# EAGLE design Adafruit HUZZAH ESP8266 Basic Breakout (EAGLE 9.5.2)
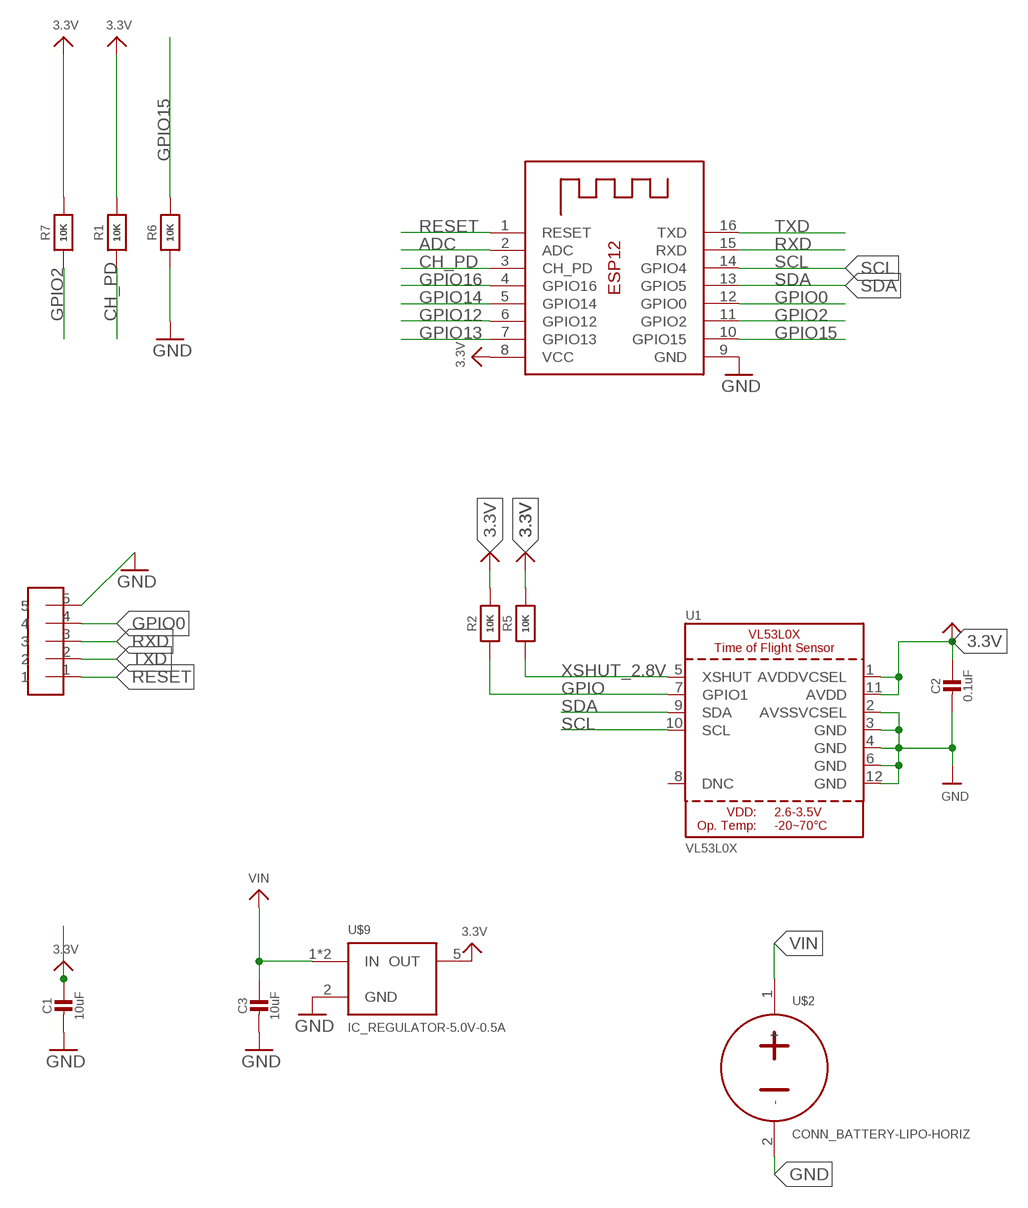
[diagram p0: schematic, sheet 1]

## Parts
C1  10uF  CAP_CERAMIC0805-NOOUTLINE  [0805-NO]
C2  0.1uF  CAP_CERAMIC0805-NOOUTLINE  [0805-NO]
C3  10uF  CAP_CERAMIC0805-NOOUTLINE  [0805-NO]
R1  10K  RESISTOR0805_NOOUTLINE  [0805-NO]
R2  10K  RESISTOR0805_NOOUTLINE  [0805-NO]
R5  10K  RESISTOR0805_NOOUTLINE  [0805-NO]
R6  10K  RESISTOR0805_NOOUTLINE  [0805-NO]
R7  10K  RESISTOR0805_NOOUTLINE  [0805-NO]
U1  VL53L0X  [LGA12_ST]
U$2  CONN_BATTERY-LIPO-HORIZ  [JST-PH-2-SMT-RA]
U$4  HEADER-5-TESTPOINT  [TESTPOINT-5]
U$9  IC_REGULATOR-5.0V-0.5A  [SOT23-5]
X1  ESP-12  [ESP-12]

## Nets
3.3V: C2.1 R1.2 R2.2 R5.2 R7.2 U1.1(AVDDVCSEL) U1.11(AVDD) U$9.5(OUT) X1.8(VCC) ; supply symbol labelled 2.8V
ADC: X1.2(ADC)
CH_PD: R1.1 X1.3(CH_PD)
GND: C1.2 C2.2 C3.2 R6.1 U1.2(AVSSVCSEL) U1.3(GND) U1.4(GND) U1.6(GND) U1.12(GND) U$2.2(-) U$4.5 U$9.2(GND) X1.9(GND)
GPIO: R2.1 U1.7(GPIO1)
GPIO0: U$4.4 X1.12(GPIO0)
GPIO2: R7.1 X1.11(GPIO2)
GPIO12: X1.6(GPIO12)
GPIO13: X1.7(GPIO13)
GPIO14: X1.5(GPIO14)
GPIO15: R6.2 X1.10(GPIO15)
GPIO16: X1.4(GPIO16)
RESET: U$4.1 X1.1(RESET)
RXD: U$4.3 X1.15(RXD)
SCL: U1.10(SCL) X1.14(GPIO4)
SDA: U1.9(SDA) X1.13(GPIO5)
TXD: U$4.2 X1.16(TXD)
VIN: C1.1 C3.1 U$2.1(+) U$9.1(IN) U$9.3(IN) ; supply symbol labelled 3.3V
XSHUT_2.8V: R5.1 U1.5(XSHUT)
Unconnected: U1.8(DNC)

## Library data of the parts
C1-C3 = microbuilder:CAP_CERAMIC: Ceramic Capacitors For new designs, use the packages preceded by an '_' character since they are more reliable: The following footprints should be used on most boards: _0402 - Standard footprint for regular board layouts _0603 - Standard footprint for regular board layouts _0805 - Standard footprint for regular board layouts _1206 - Standard footprint for regular board layouts For extremely tight-pitch boards where space is at a premium, the following 'micro-pitch' footprints can be used (smaller pads, no silkscreen outline, etc.): _0402MP - Micro-pitch footprint for very dense/compact boards _0603MP - Micro-pitch footprint for very dense/compact boards _0805MP - Micro-pitch footprint for very dense/compact boards _1206MP - Micro-pitch footprint for very dense/compact boards
R1 R2 R5-R7 = microbuilder:RESISTOR: Resistors For new designs, use the packages preceded by an '_' character since they are more reliable: The following footprints should be used on most boards: _0402 - Standard footprint for regular board layouts _0603 - Standard footprint for regular board layouts _0805 - Standard footprint for regular board layouts _1206 - Standard footprint for regular board layouts For extremely tight-pitch boards where space is at a premium, the following 'micro-pitch' footprints can be used (smaller pads, no silkscreen outline, etc.): _0402MP - Micro-pitch footprint for very dense/compact boards _0603MP - Micro-pitch footprint for very dense/compact boards _0805MP - Micro-pitch footprint for very dense/compact boards _1206MP - Micro-pitch footprint for very dense/compact boards
U1 = microbuilder:VL53L0X: VL53L0X - Laser Time of Flight Sensor (2M range)
U$2 = homemade-hardware:CONN_BATTERY
U$4 = homemade-hardware:HEADER-5: NPTC081KFXC-RC <https://www.digikey.com/product-detail/en/sullins-connector-solutions/NPTC081KFXC-RC/S5600-ND/776058>: Vertical Female SMD Headers TSM-110-01-T-SV <https://www.digikey.com/product-detail/en/samtec-inc/TSM-110-01-T-SV/SAM12267-ND/6691889>: Vertical Male SMD Headers M20-8890845 <https://www.digikey.com/products/en?keywords=952-3236-ND>: Horizontal Male SMD Headers M20-7910842R <https://www.digikey.com/product-detail/en/harwin-inc/M20-7910842R/952-3200-6-ND/6559341>: Horizontal Female SMD Headers
U$9 = homemade-hardware:IC_REGULATOR: SPX3819M5-L-5-0/TR <https://www.digikey.com/product-detail/en/maxlinear-inc/SPX3819M5-L-5-0-TR/1016-1874-6-ND/3586704>: 5.0V/0.5A SMD Linear Regulator SPX3819M5-L-3-3/TR <https://www.digikey.com/product-detail/en/maxlinear-inc/SPX3819M5-L-3-3-TR/1016-1873-6-ND/3586703>: 3.3V/0.5A SMD Linear Regulator; PN: SPX3819M5-L-5-0/TR
X1 = microbuilder:ESP-12

## Board
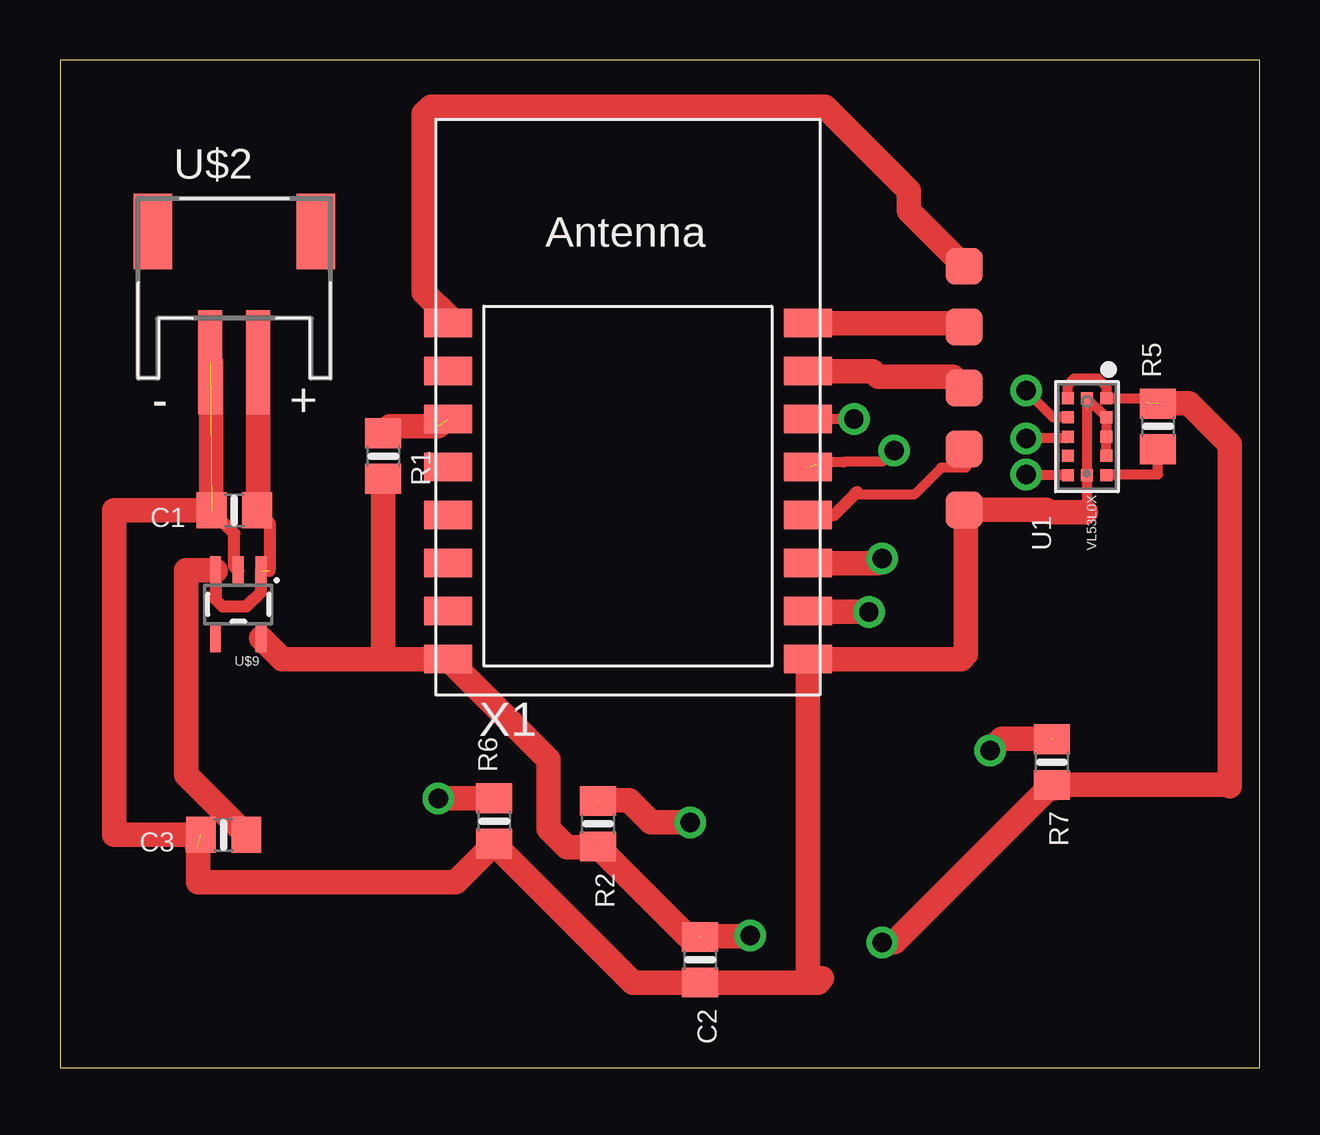
[diagram p1: board, top side]
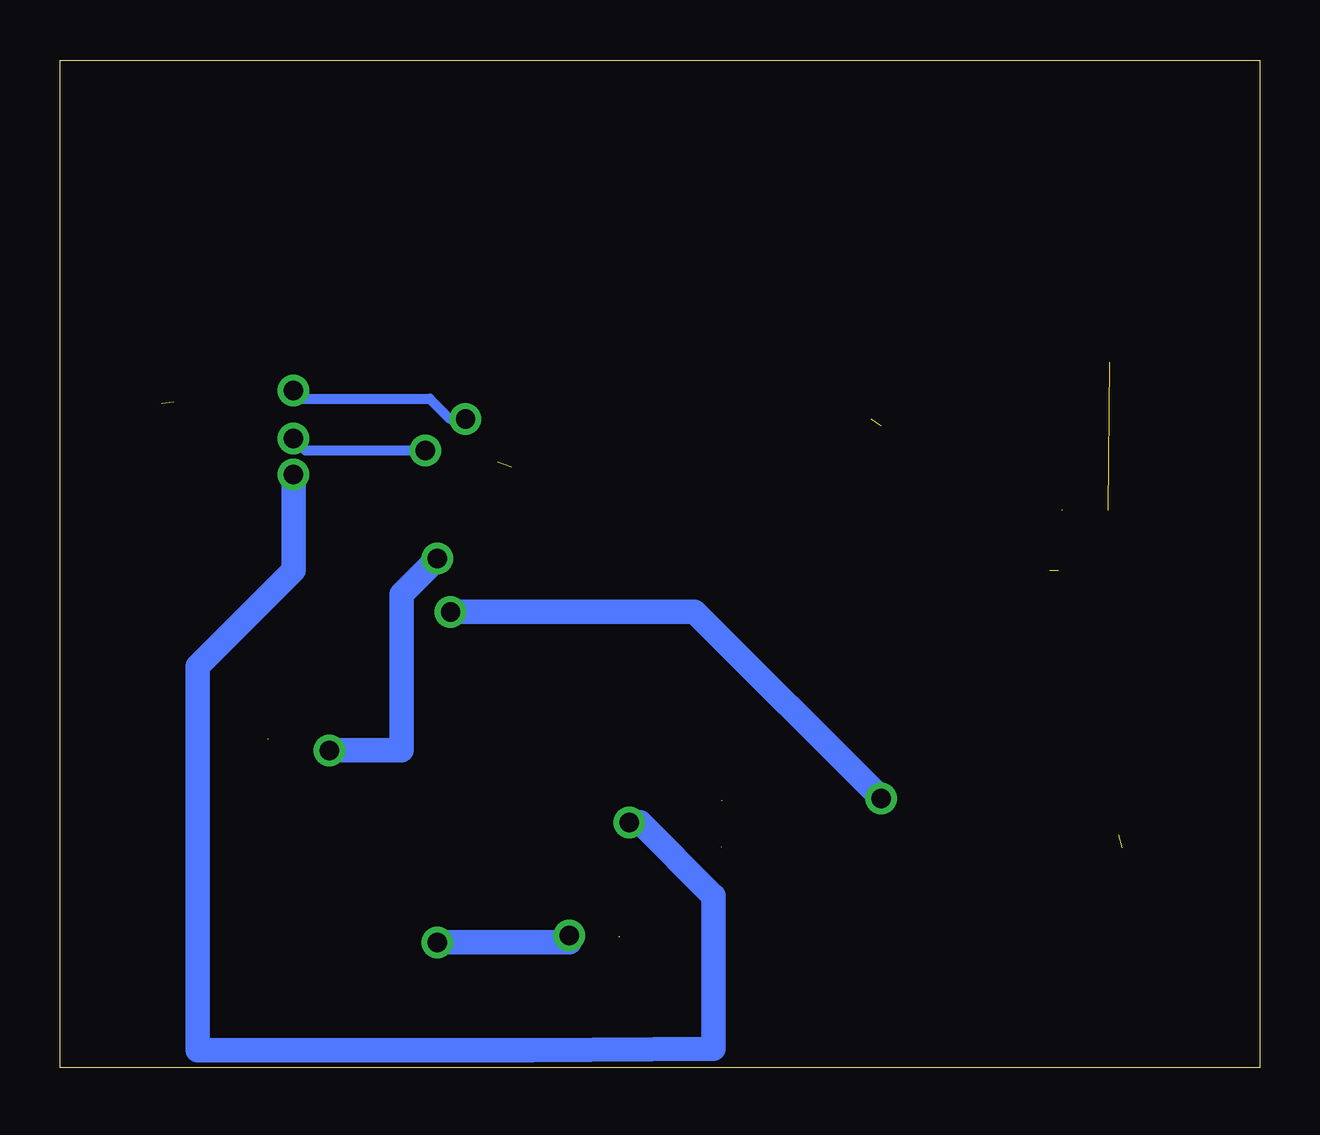
[diagram p2: board, bottom side, seen from below]

Size 50 x 42 mm. Coordinates in mm from the lower left corner, seen from the top.
Outline: 0,0 50,0 50,42 0,42 0,0
Copper layers (1*16): Top 0.035mm / dielectric 1.5mm / Bottom 0.035mm
Design rules "default": minimum track width 16mil, minimum drill 0.8mm, track to track 0.8mm, track to pad 0.8mm, pad to pad 0.8mm, via to via 0.8mm, smd to smd 0mil, copper to edge 1mil, drill to drill 1mil, minimum pad ring 10mil, minimum via ring 10mil, stop-mask expansion 1mil, vias tented up to drill 30mil, thermal gap 10mil

### Footprints (pad centres in the part's own frame; a part is rotated, then mirrored left to right if it is on the bottom)
0805-NO = smd 1.24 x 1.5: 1 -0.95,0; 2 0.95,0
LGA12_ST = smd 0.5 x 0.5: 1 1.6,-0.8; 2 0.8,-0.8; 3 0,-0.8; 4 -0.8,-0.8; 5 -1.6,-0.8; 6 -1.6,0; 7 -1.6,0.8; 8 -0.8,0.8; 9 0,0.8; 10 0.8,0.8; 11 1.6,0.8; 12 1.6,0
JST-PH-2-SMT-RA = smd 1 x 4.35: 1 1,-3.825; 2 -1,-3.825 | smd 1.6 x 3.15: NC1 -3.4,1.625; NC2 3.4,1.625
TESTPOINT-5 = smd 1.524 x 1.524: 1 0,0; 2 2.54,0; 3 5.08,0; 4 7.62,0; 5 10.16,0
SOT23-5 = smd 0.45 x 1.2: 1 -0.95,-1.4; 2 0,-1.4; 3 0.95,-1.4; 4 0.95,1.4; 5 -0.95,1.4
ESP-12 = smd 2 x 1.2: 1 -7.5,4.5; 2 -7.5,2.5; 3 -7.5,0.5; 4 -7.5,-1.5; 5 -7.5,-3.5; 6 -7.5,-5.5; 7 -7.5,-7.5; 8 -7.5,-9.5; 9 7.5,-9.5; 10 7.5,-7.5; 11 7.5,-5.5; 12 7.5,-3.5; 13 7.5,-1.5; 14 7.5,0.5; 15 7.5,2.5; 16 7.5,4.5

### Placement (x,y rotation side)
C1  7.27,23.23 180 top
C2  26.68,4.51 270 top
C3  6.82,9.71 180 top
R1  13.47,25.5 270 top
R2  22.43,10.17 270 top
R5  45.77,26.73 90 top
R6  18.1,10.29 90 top
R7  41.35,12.74 270 top
U1  42.81,26.31 90 top
U$2  7.27,33.23 0 top
U$4  37.69,33.41 270 top
U$9  7.43,19.31 180 top
X1  23.67,26.54 0 top

### Tracks (layer width: path | path; a pad name or v marks a point on that pad's centre or on a via)
3.3V  (via drill 0.8)  (4 unrouted)
  Top 0.406: 45.27,27.73 45.09,27.91 U1.1 43.61,28.39 43.27,28.73 42.27,28.73 42.01,28.47 U1.11
  Top 1.016: 41.47,11.66 R7.2 | U$9.5 9.25,17.04 13.27,17.04 | 13.27,17.04 X1.8 20.37,12.84 20.37,9.96 21.13,9.2 22.43,9.2 | R1.2 13.47,17.24 13.27,17.04 | R2.2 26.19,5.46 C2.1 | R7.2 48.71,11.79 48.77,11.73 48.77,26 47.06,27.71 45.77,27.71 | R7.2 34.78,5.23 v34.27,5.23 | v28.77,5.52 28.74,5.49 26.68,5.49
  Bottom 1.016: v34.27,5.23 28.77,5.23 v28.77,5.52
CH_PD  (1 unrouted)
  Top 1.016: R1.1 13.76,26.73 15.77,26.73
GND  (2 unrouted)
  Top 0.406: U1.4 U1.3 U1.2 U1.12 U1.6 42.81,23.19 42.77,23.15
  Top 0.508: 6.55,23 C1.2 7.27,22.28 7.27,20.88 U$9.2
  Top 1.016: U$2.2 6.29,29.38 6.29,23.23 2.27,23.23 2.27,9.71 C3.2 | 5.73,9.19 5.77,9.14 5.77,7.73 16.49,7.73 R6.1 23.88,3.56 C2.2 31.6,3.56 | 31.6,3.56 31.77,3.73 | X1.9 31.17,3.99 31.6,3.56 | X1.9 31.26,17.13 | 42.77,23.15 41.22,23.15 41.11,23.25 U$4.5 37.77,23.17 37.77,17.23 37.58,17.04 X1.9
GPIO  (via drill 0.8)  (1 unrouted)
  Top 0.406: U1.7 40.29,24.71 v40.27,24.73
  Top 1.016: 22.43,11.15 23.72,11.15 24.64,10.23 v26.27,10.23
  Bottom 1.016: v40.27,24.73 40.27,20.73 43.77,17.23 44.27,16.73 44.27,0.73 30.34,0.73 22.77,0.81 22.77,7.17 22.83,7.23 25.83,10.23 v26.27,10.23
GPIO0
  Top 0.406: X1.12 31.3,22.91 | U$4.4 37.77,25.71 37.77,25.01 36.74,25.01 35.61,23.89 33.11,23.89
  Top 0.508: X1.12 32.26,23.04 33.11,23.89 33.22,24
GPIO2  (via drill 0.8)  (1 unrouted)
  Top 1.016: X1.11 34.08,21.04 v34.27,21.23 | v38.77,13.23 39.26,13.72 41.35,13.72
  Bottom 1.016: v34.27,21.23 35.77,19.73 35.77,13.23 v38.77,13.23
GPIO15  (via drill 0.8)
  Top 1.016: R6.2 v15.78,11.24 v15.77,11.23 | v33.72,19 31.21,19 X1.10
  Bottom 1.016: v15.77,11.23 23.54,19 v33.72,19
RESET
  Top 1.016: 16.26,30.95 X1.1 16.17,31.32 15.16,32.33 15.16,39.75 15.46,40.05 31.88,40.05 35.38,36.55 35.38,35.72 U$4.1
RXD
  Top 1.016: X1.15 33.87,29.04 34.11,28.8 37.22,28.8 U$4.3
SCL  (via drill 0.8)
  Top 0.406: U1.10 41.39,27.11 v40.27,28.23 | v33.1,27.04 X1.14
  Top 1.016: X1.14 31.26,27.13
  Bottom 0.406: v40.27,28.23 39.93,27.89 34.58,27.89 33.73,27.04 v33.1,27.04
SDA  (via drill 0.8)  (1 unrouted)
  Top 0.406: U1.9 41.93,26.23 v40.27,26.23 | 31.77,25.23 32.67,25.23 32.7,25.26 34.3,25.26 v34.77,25.73
  Bottom 0.406: v40.27,26.23 39.77,25.73 v34.77,25.73
TXD
  Top 1.016: X1.16 37.52,31.04 U$4.2
VIN  (2 unrouted)
  Top 0.508: C1.1 8.74,22.71 8.74,20.71 | U$9.3 6.48,19.52 6.77,19.23 7.77,19.23 8.38,19.84 U$9.1
  Top 1.016: U$2.1 8.27,23.28 8.25,23.26 8.25,23.23 | C3.1 5.27,12.21 5.27,20.73 6.46,20.73 U$9.3
XSHUT_2.8V
  Top 0.406: U1.5 43.63,24.73 45.77,24.73 R5.1